# Altium schematic sheet Peripheral-ICs.SchDoc
size A4
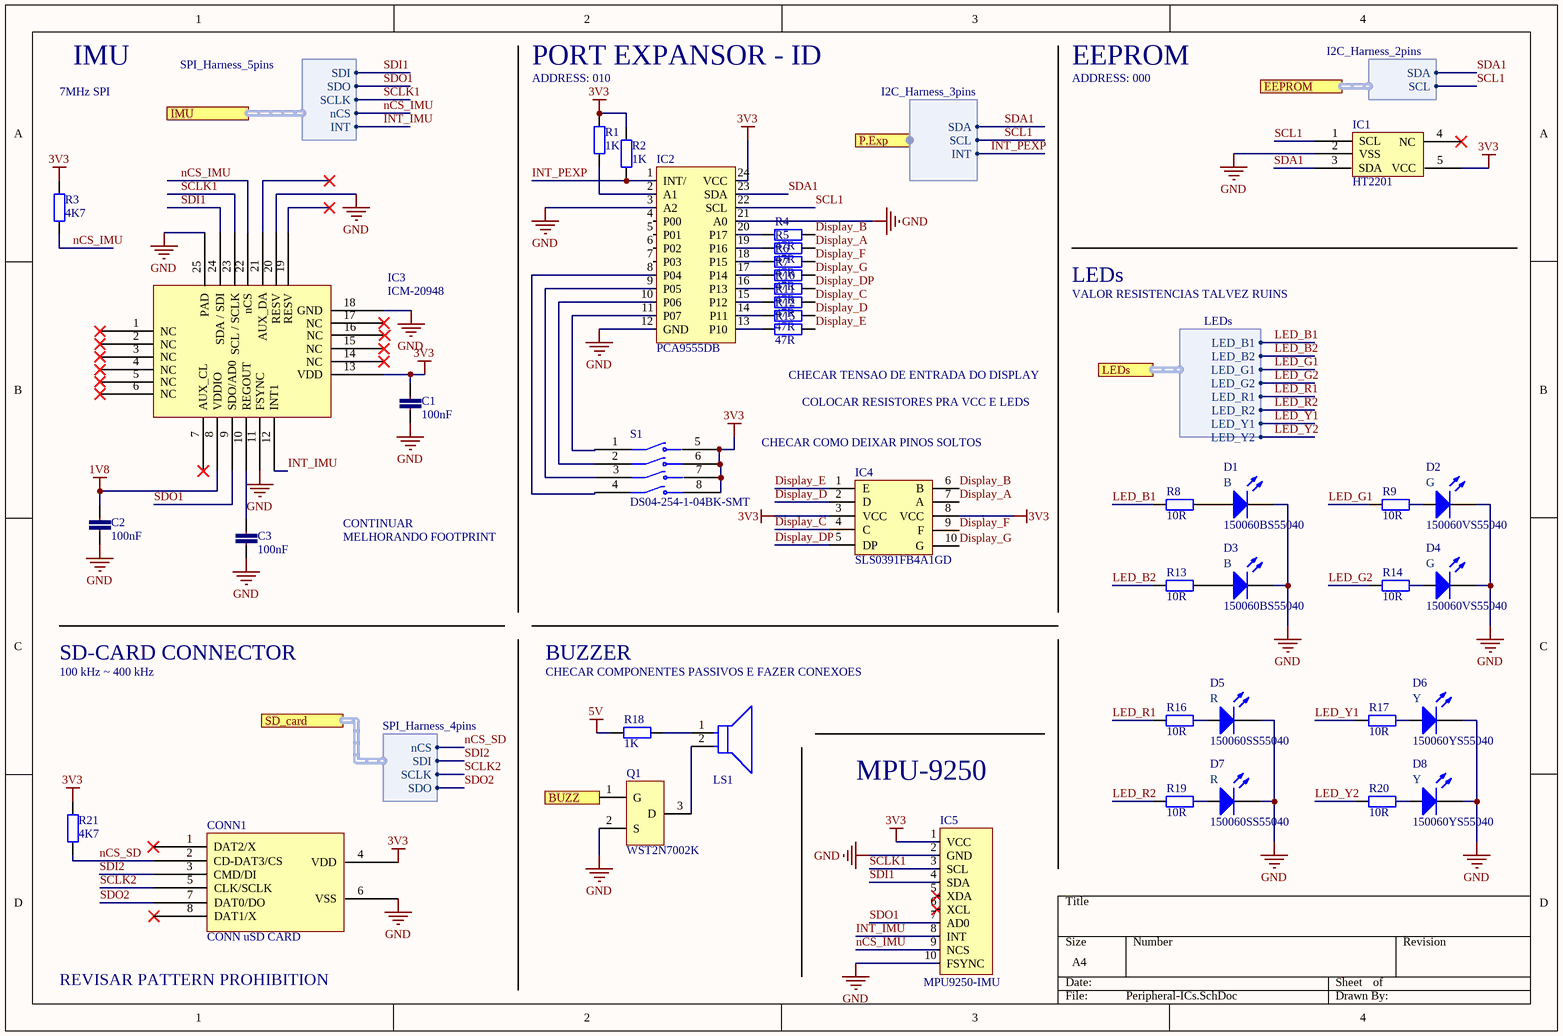
[diagram p0: Peripheral-ICs.SchDoc]

## Parts
C1  100nF  [CAP CER 0603]
C2  100nF  [CAP CER 0603]
C3  100nF  [CAP CER 0603]
CONN1  CONN uSD CARD  [2908-05WB-MG]
D1  150060BS55040  [LED 0603 BLUE]
D2  150060VS55040  [LED 0603 GREEN]
D3  150060BS55040  [LED 0603 BLUE]
D4  150060VS55040  [LED 0603 GREEN]
D5  150060SS55040  [LED 0603 RED]
D6  150060YS55040  [LED 0603 YELLOW]
D7  150060SS55040  [LED 0603 RED]
D8  150060YS55040  [LED 0603 YELLOW]
IC1  HT2201  [SOT-23-5]
IC2  PCA9555DB  [SSOP-24]
IC3  ICM-20948  [ICM-20948]
IC4  SLS0391FB4A1GD  [LDS-SMHTA304RISITR]
IC5  MPU9250-IMU  [MPU9250-IMU]
LS1  Speak_TDK_PS1420P02CT_eec  [TDK_PS1420P02CT_0]  (value not drawn)
Q1  WST2N7002K  [SOT-23-3]
R1  1K  [RES SMD 0603]
R2  1K  [RES SMD 0603]
R3  4K7  [RES SMD 0603]
R4  47R  [RES SMD 0603]
R5  47R  [RES SMD 0603]
R6  47R  [RES SMD 0603]
R7  47R  [RES SMD 0603]
R8  10R  [RES SMD 0603]
R9  10R  [RES SMD 0603]
R10  47R  [RES SMD 0603]
R11  47R  [RES SMD 0603]
R12  47R  [RES SMD 0603]
R13  10R  [RES SMD 0603]
R14  10R  [RES SMD 0603]
R15  47R  [RES SMD 0603]
R16  10R  [RES SMD 0603]
R17  10R  [RES SMD 0603]
R18  1K  [RES SMD 0603]
R19  10R  [RES SMD 0603]
R20  10R  [RES SMD 0603]
R21  4K7  [RES SMD 0603]
S1  DS04-254-1-04BK-SMT  [DS04-254-1-04BK-SMT]

## Ports
BUZZ (in), EEPROM (harness I2C_Harness_2pins), IMU (harness SPI_Harness_5pins), LEDs (harness LEDs), P.Exp (harness I2C_Harness_3pins), SD_card (harness SPI_Harness_4pins)

## Harnesses
SPI_Harness_5pins: SDI, SDO, SCLK, nCS, INT
SPI_Harness_4pins: nCS, SDI, SCLK, SDO
I2C_Harness_3pins: SDA, SCL, INT
I2C_Harness_2pins: SDA, SCL
LEDs: LED_B1, LED_B2, LED_G1, LED_G2, LED_R1, LED_R2, LED_Y1, LED_Y2

## Nets
1V8: C2.1 IC3.8(VDDIO)
3V3: C1.1 CONN1.4(VDD) IC1.5(VCC) IC2.24(VCC) IC3.13(VDD) IC4.3(VCC) IC4.8(VCC) IC5.1(VCC) R1.2 R2.2 R3.2 R21.2 S1.5 S1.6 S1.7 S1.8
5V: R18.2
GND: C1.2 C2.2 C3.2 CONN1.6(VSS) D1.2(N) D2.2(N) D3.2(N) D4.2(N) D5.2(N) D6.2(N) D7.2(N) D8.2(N) IC1.2(VSS) IC2.3(A2) IC2.12(GND) IC2.21(A0) IC3.11(FSYNC) IC3.18(GND) IC3.20(RESV) IC3.25(PAD) IC5.2(GND) IC5.10(FSYNC) Q1.2(S)
BUZZ: Q1.1(G) ; port BUZZ
Display_A: IC4.7(A) R5.2
Display_B: IC4.6(B) R4.2
Display_C: IC4.4(C) R11.2
Display_D: IC4.2(D) R12.2
Display_DP: IC4.5(DP) R10.2
Display_E: IC4.1(E) R15.2
Display_F: IC4.9(F) R6.2
Display_G: IC4.10(G) R7.2
INT_IMU: IC3.12(INT1) IC5.8(INT) ; port IMU.INT
INT_PEXP: IC2.1(INT/) R2.1 ; port P.Exp.INT
LED_B1: R8.2 ; port LEDs.LED_B1
LED_B2: R13.2 ; port LEDs.LED_B2
LED_G1: R9.2 ; port LEDs.LED_G1
LED_G2: R14.2 ; port LEDs.LED_G2
LED_R1: R16.2 ; port LEDs.LED_R1
LED_R2: R19.2 ; port LEDs.LED_R2
LED_Y1: R17.2 ; port LEDs.LED_Y1
LED_Y2: R20.2 ; port LEDs.LED_Y2
nCS_IMU: IC3.22(nCS) IC5.9(NCS) R3.1 ; port IMU.nCS
nCS_SD: CONN1.2(CD-DAT3/CS) R21.1 ; port SD_card.nCS
SCL1: IC1.1(SCL) IC2.22(SCL) ; port P.Exp.SCL, port EEPROM.SCL
SCLK1: IC3.23(SCL_/_SCLK) IC5.3(SCL) ; port IMU.SCLK
SCLK2: CONN1.5(CLK/SCLK) ; port SD_card.SCLK
SDA1: IC1.3(SDA) IC2.23(SDA) ; port P.Exp.SDA, port EEPROM.SDA
SDI1: IC3.24(SDA_/_SDI) IC5.4(SDA) ; port IMU.SDI
SDI2: CONN1.3(CMD/DI) ; port SD_card.SDI
SDO1: IC3.9(SDO/AD0) IC5.7(AD0) ; port IMU.SDO
SDO2: CONN1.7(DAT0/DO) ; port SD_card.SDO
NetC3_1: C3.1 IC3.10(REGOUT)
NetD1_1: D1.1(P) R8.1
NetD2_1: D2.1(P) R9.1
NetD3_1: D3.1(P) R13.1
NetD4_1: D4.1(P) R14.1
NetD5_1: D5.1(P) R16.1
NetD6_1: D6.1(P) R17.1
NetD7_1: D7.1(P) R19.1
NetD8_1: D8.1(P) R20.1
NetIC2_2: IC2.2(A1) R1.1
NetIC2_8: IC2.8(P04) S1.4
NetIC2_9: IC2.9(P05) S1.3
NetIC2_10: IC2.10(P06) S1.2
NetIC2_11: IC2.11(P07) S1.1
NetIC2_13: IC2.13(P10) R15.1
NetIC2_14: IC2.14(P11) R12.1
NetIC2_15: IC2.15(P12) R11.1
NetIC2_16: IC2.16(P13) R10.1
NetIC2_17: IC2.17(P14) R7.1
NetIC2_18: IC2.18(P15) R6.1
NetIC2_19: IC2.19(P16) R5.1
NetIC2_20: IC2.20(P17) R4.1
NetLS1_1: LS1.1 R18.1
NetLS1_2: LS1.2 Q1.3(D)

Not connected (* = marked no-connect by the designer): CONN1 1(DAT2/X)* 8(DAT1/X)*; IC1 4(NC)*; IC2 4(P00) 5(P01) 6(P02) 7(P03); IC3 1(NC)* 2(NC)* 3(NC)* 4(NC)* 5(NC)* 6(NC)* 7(AUX_CL)* 14(NC)* 15(NC)* 16(NC)* 17(NC)* 19(RESV)* 21(AUX_DA)*; IC5 5(XDA)* 6(XCL)*

## Notes on the sheet
- 7MHz SPI
- IMU
- ADDRESS: 010
- PORT EXPANSOR - ID
- ADDRESS: 000
- EEPROM
- LEDs
- VALOR RESISTENCIAS TALVEZ RUINS
- CHECAR TENSAO DE ENTRADA DO DISPLAY
- (near IC4) CHECAR COMO DEIXAR PINOS SOLTOS
- COLOCAR RESISTORES PRA VCC E LEDS
- CONTINUAR
- MELHORANDO FOOTPRINT
- SD-CARD CONNECTOR
- 100 kHz ~ 400 kHz
- CHECAR COMPONENTES PASSIVOS E FAZER CONEXOES
- BUZZER
- MPU-9250
- REVISAR PATTERN PROHIBITION
- (in symbol 150060BS55040) B
- (in symbol 150060SS55040) R
- (in symbol 150060VS55040) G
- (in symbol 150060YS55040) Y

## Library data of the parts
C1-C3 = CAP CER 0603 25V 100nF: Multilayer Ceramic Capacitors MLCC - SMD/SMT 25V 0.1uF 0603 Y5V -20/+80%; Mfr Nr: C0603C104Z3VACTU; Mfr: KEMET; Type: Ceramic Capacitor; Dimensions: 0603 (1608 metric); Voltage Rating: 25V; Series: SMD Comm Y5V; Value: 100nF
CONN1 = 2908-05WB-MG: 8 Position Card Connector Secure Digital - microSD™ Surface Mount, Right Angle Gold; ComponentLink1Description: Datasheet; ComponentLink1URL: https://multimedia.3m.com/mws/media/416257O/3mtm-card-connector-microsdtm-2900-series-ts2197.pdf
D1 D3 = 150060BS55040: Standard LEDs - SMD WL-SMCD SMD Mono SMD 0603 Blue 465nm; Mfr: Wurth Elektronik; Forward Current: 20mA; Forward Voltage: 2V; Package: 0603 (1608 metric); Series: WL-SMCD; Color: Blue
D2 D4 = 150060VS55040: Standard LEDs - SMD WL-SMCD SMD MonoChip 0603 BrtGrn 575nm; Mfr: Wurth Elektronik; Forward Current: 20mA; Forward Voltage: 2V; Color: Green; Package: 0603 (1608 metric); Series: WL-SMCD
D5 D7 = 150060SS55040: Standard LEDs - SMD WL-SMCD SMD MonoChip 0603 Super Red 645nm; Mfr: Wurth Elektronik; Forward Current: 20mA; Forward Voltage: 2V; Package: 0603 (1608 metric); Series: WL-SMCD; Color: Red
D6 D8 = 150060YS55040: Standard LEDs - SMD WL-SMCD SMD MonoChip 0603 Yllw 591nm; Mfr: Wurth Elektronik; Forward Current: 20mA; Forward Voltage: 2V; Color: Yellow; Package: 0603 (1608 metric); Series: WL-SMCD
IC1 = HT2201: EEPROM EEPROM 1KB (128 X 8) I2C SOT-23-5 ROHS; Mfr: Holtek Semicon; Mfr Nr: HT2201; Package: SOT-23-5
IC2 = PCA9555DB: INTERFACE - I/O EXPANDERS SSOP-24 ROHS; Mfr: NXP Semicon; Mfr Nr: PCA9555DB,118; Nr of I/Os: 16 I/O; Supply Voltage: 5.5V; Package: SSOP-24_5.3x8.2x0.65P
IC3 = ICM-20948: IMU ACCEL/GYRO/COMPI2C/SPI 24QFN; ComponentLink1Description: Datasheet; ComponentLink1URL: https://invensense.tdk.com/wp-content/uploads/2016/06/DS-000189-ICM-20948-v1.3.pdf
IC4 = SLS0391FB4A1GD: 1 0.39''(9.91MM) ANODE(POSITIVE ELECTRODE) BLUE 473NM SMD LED SEGMENT DISPLAY ROHS; Mfr: SUNLIGHT; ComponentLink1Description: Datasheet; ComponentLink1URL: https://www.lumex.com/spec/LDS-SMHTA304RISITR.pdf; Mfr Nr: SLS0391FB4A1GD; Package: SMD-10_9.8x13.0x1.88P
LS1 = Speak_TDK_PS1420P02CT_eec: SPEAK AUDIO PIEZO TRANSDUCER 30V TH; Manufacturer: TDK; Part Number: PS1420P02CT; helpURL: https://upverter.com/upn/revision/c40fcc79eb057440/; ComponentLink2Description: Datasheet; Temperature: -10°C to +70°C; Package: PTH_BZ; Supplier 2: Mouser; Price: 0.484234236378; Supplier 1: Digi-Key; ComponentLink1URL: https://upverter.com/upn/revision/c40fcc79eb057440/; Supplier Part Number 2: 810-PS1420P02CT; Supplier Part Number 1: 445-2526-1-ND; ComponentLink1Description: Upverter; ComponentLink2URL: https://upverter.com/datasheet/458958daf548c3d54cf9a7d1ea1ff395e223655a.pdf; RoHS: TRUE; Mouser Part Number: 810-PS1420P02CT; Ipc Land Pattern Name: CAPRD500W80D1400H1100; Temperature Range High: +70°C; Digikey Description: SPEAK AUDIO PIEZO TRANSDUCER 30V TH; Digikey Part Number: 445-2526-1-ND; Lead Free: yes; Temperature Range Low: -10°C
Q1 = WST2N7002K: MOSFET N TRENCH 60V 300MA 2.5V @ 250UA 3 ? @ 500MA,10V SOT-23(SOT-23-3) ROHS; Mfr: Winsok Semicon; ComponentLink1Description: Datasheet; ComponentLink1URL: https://br.mouser.com/datasheet/2/408/T2N7002AK_datasheet_en_20150401-708738.pdf; Mfr Nr: WST2N7002K; Package: SOT-23-3
R1 R2 R18 = RES SMD 0603 1K: Thick Film Resistors 1/10Watt 1Kohms 1% Commercial Use; Mfr: Vishay / Dale; Mfr Nr: CRCW06031K00FKEAC; Power Rating: 1/10 W; Dimensions: 0603 (1608 metric); Value: 1K
R3 R21 = RES SMD 0603 4K7
R4-R7 R10-R12 R15 = RES SMD 0603 47R: Thick Film Resistors 1/10Watt 47ohms 1% Commercial Use; Mfr: Vishay / Dale; Mfr Nr: CRCW060347R0FKEAC; Power Rating: 1/10 W; Dimensions: 0603 (1608 metric); Value: 47R
R8 R9 R13 R14 R16 R17 R19 R20 = RES SMD 0603 10R: Thick Film Resistors 1/10Watt 10ohms 1% Commercial Use; Mfr: Vishay / Dale; Mfr Nr: CRCW060310R0FKEAC; Power Rating: 1/10 W; Dimensions: 0603 (1608 metric); Value: 10R
S1 = DS04-254-1-04BK-SMT: Dip Switch SPST 4 Position Surface Mount Slide (Standard) Actuator 25mA 24VDC; ComponentLink1Description: Datasheet; ComponentLink1URL: https://br.mouser.com/datasheet/2/670/ds04-254-smt-1777718.pdf